# Altium schematic sheet boost_nguyenLy.SchDoc
size A4
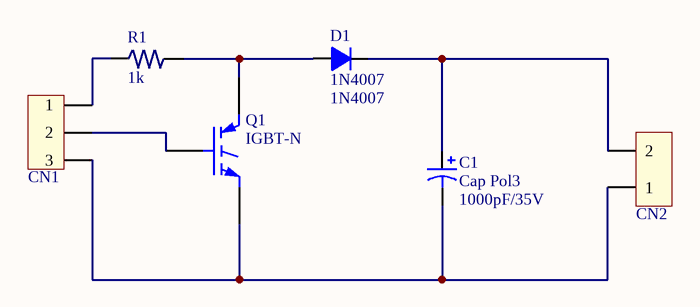
[diagram p0: boost_nguyenLy.SchDoc]

## Parts
C1  Cap Pol3  value 1000pF/35V  [CP2/5]
CN1  Con3/Header3  [CON3-2]  (value not drawn)
CN2  Con2/Header2  [CON2-1]  (value not drawn)
D1  1N4007  [Diode]
Q1  IGBT-N  [TO-247]
R1  1k  [RESISTOR 2W]

## Nets
NetC1_1: C1.1 CN2.2 D1.2(K)
NetC1_2: C1.2 CN1.3 CN2.1 Q1.3(E)
NetCN1_1: CN1.1 R1.1
NetCN1_2: CN1.2 Q1.1(G)
NetD1_1: D1.1(A) Q1.2(C) R1.2

## Library data of the parts
C1 = Cap Pol3_2: Polarized Capacitor (Surface Mount); VALUE: C?; LatestRevisionDate: 17-Jul-2002; LatestRevisionNote: Re-released for DXP Platform.; PackageReference: C0805; Publisher: Altium Limited
CN1 = Con3/Header3: CON3
CN2 = Con2/Header2: CON2
D1 = Diode: Value: 1N4007
Q1 = IGBT-N: Insulated Gate Bipolar Transistor (N-Channel); Published: 8-Jun-2000; LatestRevisionDate: 17-Jul-2002; LatestRevisionNote: Re-released for DXP Platform.; DatasheetVersion: PD-9.684A; PackageReference: TO-247; Publisher: Altium Limited; PackageDescription: SIP with Mounting Hole; 3 Leads; Body 20 x 15.6 x 5 mm (typ); Pitch 5.45 mm; Code_JEDEC: TO-247-AC; ComponentLink1Description: Manufacturer Link; ComponentLink1URL: http://www.irf.com/
R1 = RESISTOR: Walt: 1/4W; Value: 1k